# EAGLE board bmc (EAGLE 9.6.1)
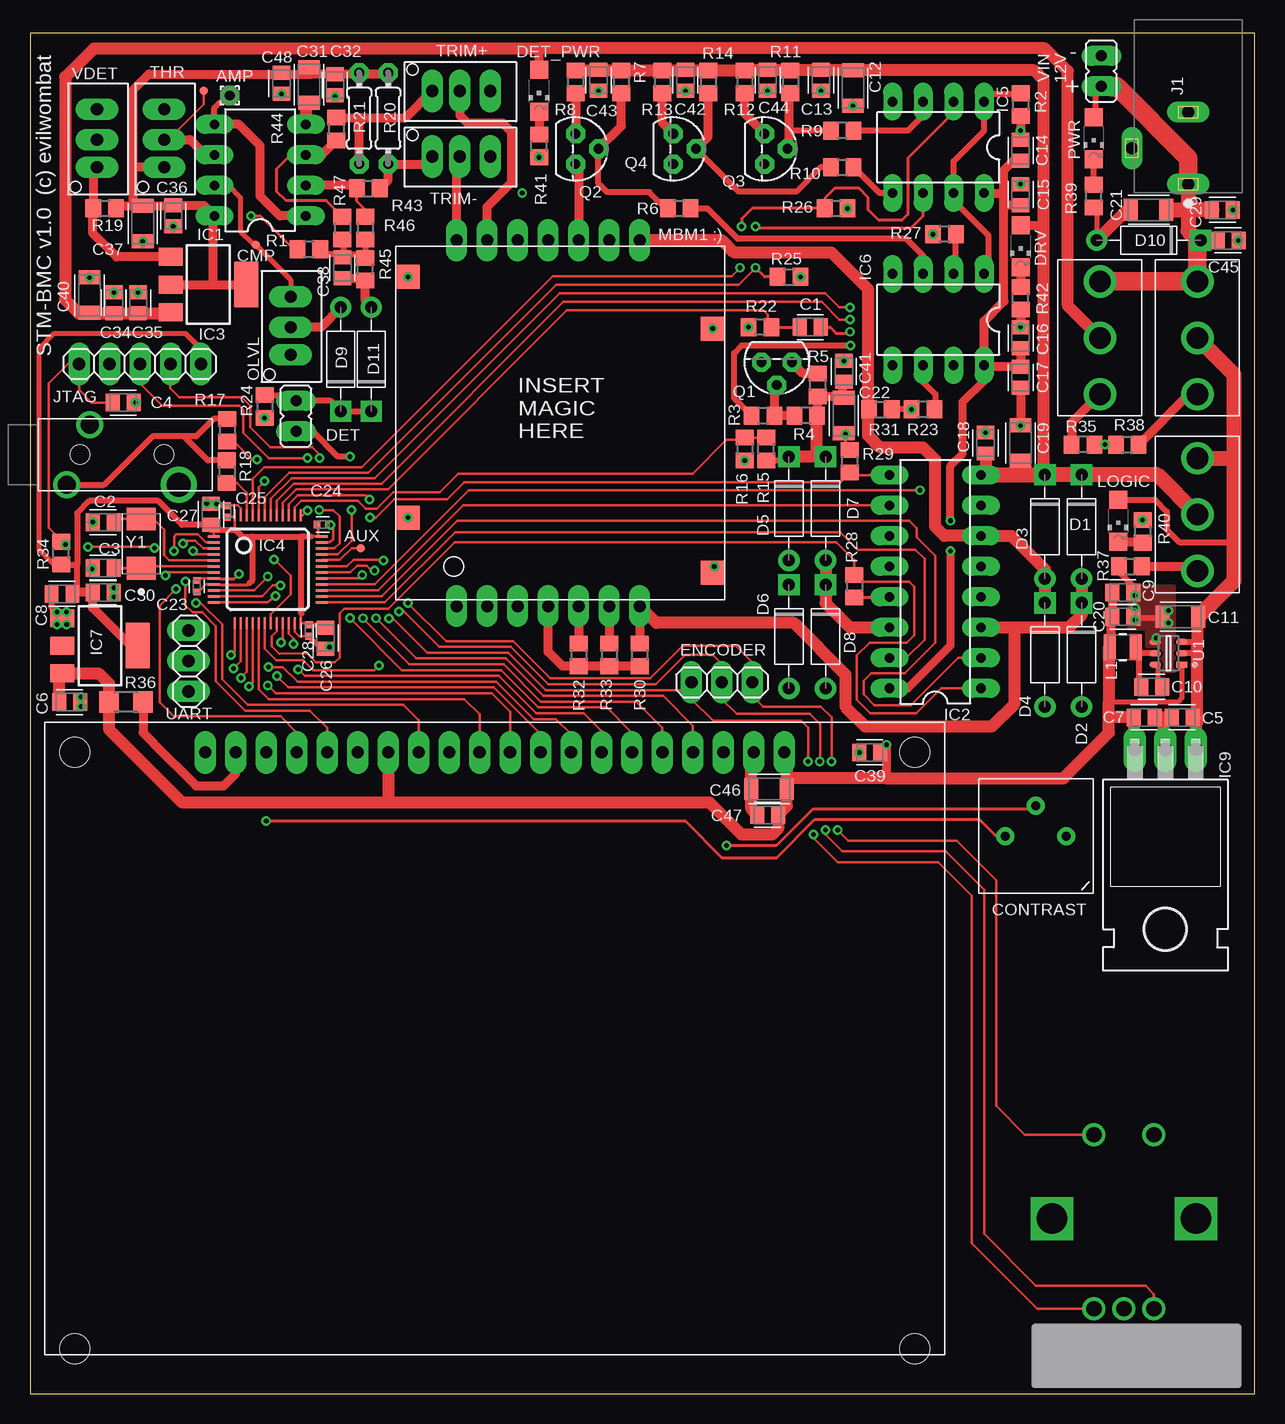
[diagram p2: board, top side]
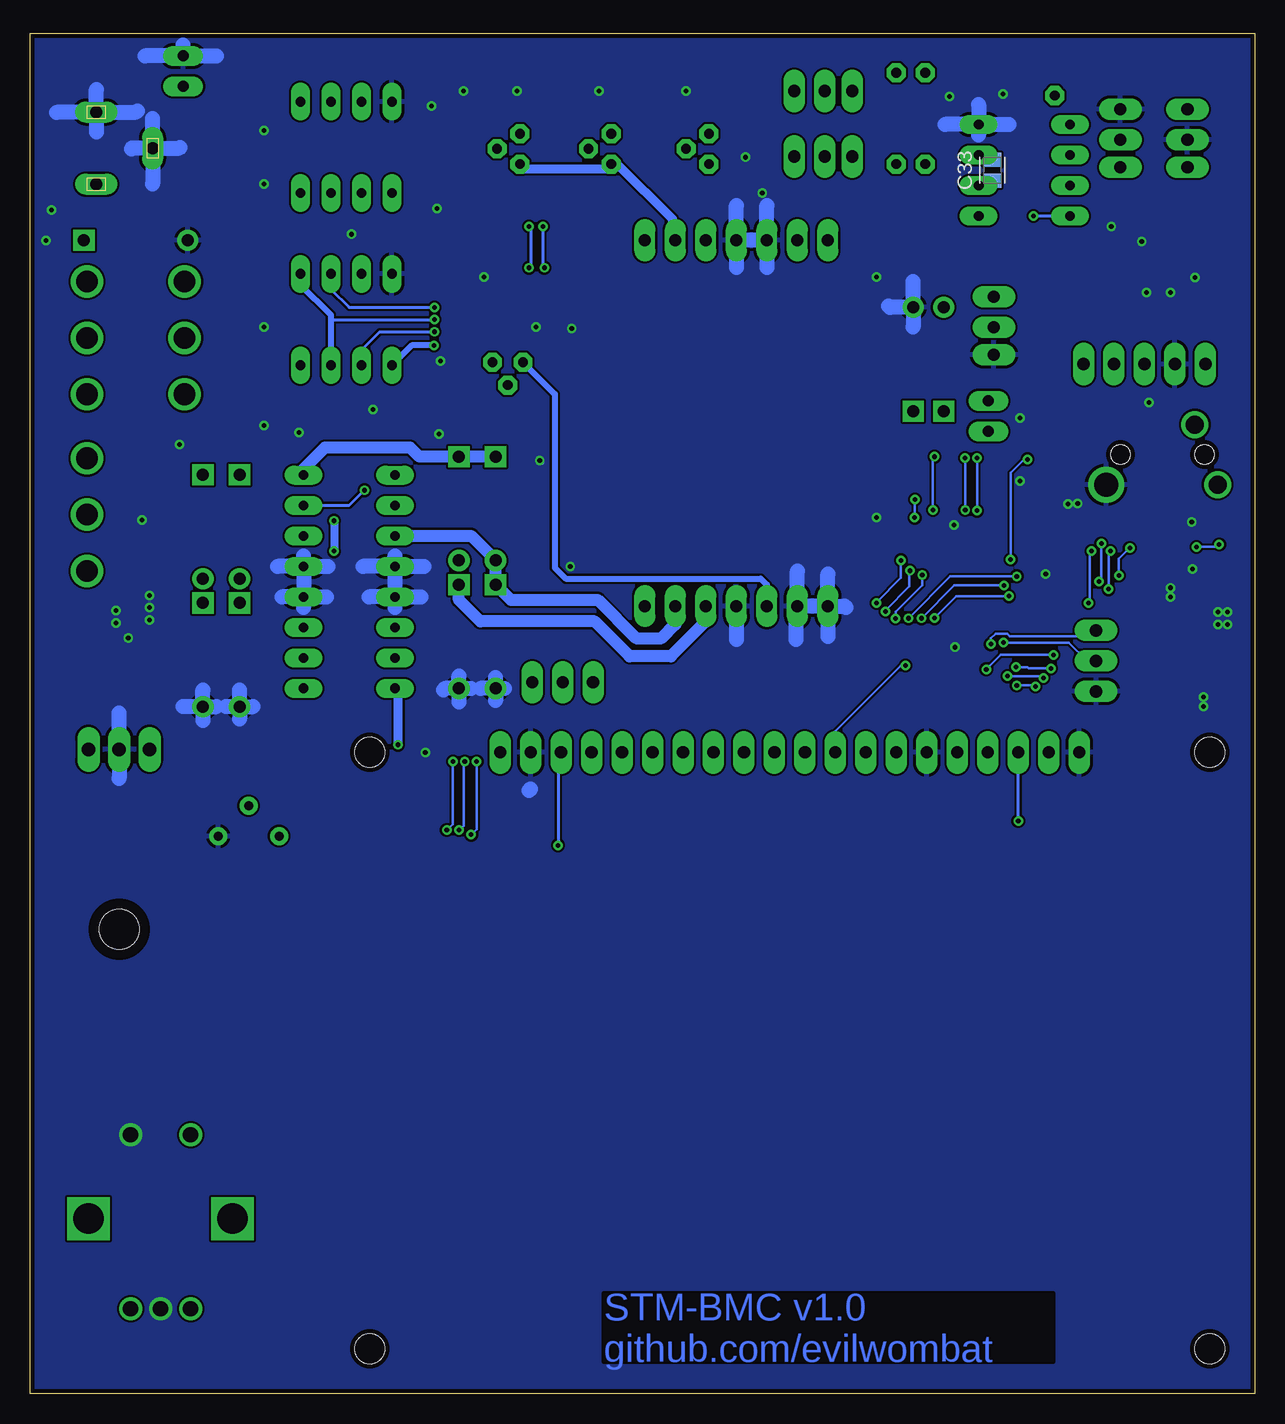
[diagram p3: board, bottom side, seen from below]

Size 102.04 x 113.41 mm. Coordinates in mm from the lower left corner, seen from the top.
Outline: 0,0 102.04,0 102.04,113.41 0,113.41 0,0
Copper layers (1*16): Top 0.035mm / dielectric 1.5mm / Bottom 0.035mm
Design rules "default *": minimum track width 7mil, minimum drill 15mil, track to track 7mil, track to pad 7mil, pad to pad 8mil, via to via 8mil, smd to smd 6mil, copper to edge 15mil, drill to drill 15mil, minimum pad ring 15mil, minimum via ring 8mil, stop-mask expansion 4mil, vias tented up to drill 0mil, thermal gap 10mil

## Footprints (pad centres in the part's own frame; a part is rotated, then mirrored left to right if it is on the bottom)
1,6/0,8 = drill 0.813 pad 1.6 octagon: 1 0,0
TP07R = smd 0.7 x 0.7: TP 0,0
CAPC2012X110 = smd 1.165 x 1.465: 1 -0.875,0; 2 0.875,0
CAPC3216X135 = smd 1.165 x 1.815: 1 -1.475,0; 2 1.475,0
CAPC1005X60 = smd 0.56 x 0.629: 1 -0.485,0; 2 0.485,0
DO-41 = drill 1: A 4.325,0 | drill 1 square: C -4.325,0
JP1 = drill 0.914 long: 1 0,-1.27; 2 0,1.27
CHIPLED_1206 = smd 1.5 x 1.5: A 0,-1.75; C 0,1.75
CFAG16864B = drill 1.016 long: 1 0,0; 2 2.54,0; 3 5.08,0; 4 7.62,0; 5 10.16,0; 6 12.7,0; 7 15.24,0; 8 17.78,0; 9 20.32,0; 10 22.86,0; 11 25.4,0; 12 27.94,0; 13 30.48,0; 14 33.02,0; 15 35.56,0; 16 38.1,0; 17 40.64,0; 18 43.18,0; 19 45.72,0; 20 48.26,0 | hole 2.5: 59.13,0; 59.13,49.7; -10.87,49.7; -10.87,0
1X03 = drill 1.016 long: 1 -2.54,0; 2 0,0; 3 2.54,0
DIL08 = drill 0.813 long: 1 -3.81,-3.81; 2 -1.27,-3.81; 3 1.27,-3.81; 4 3.81,-3.81; 5 3.81,3.81; 6 1.27,3.81; 7 -1.27,3.81; 8 -3.81,3.81
DIL16 = drill 0.813 long: 1 -8.89,-3.81; 2 -6.35,-3.81; 3 -3.81,-3.81; 4 -1.27,-3.81; 5 1.27,-3.81; 6 3.81,-3.81; 7 6.35,-3.81; 8 8.89,-3.81; 9 8.89,3.81; 10 6.35,3.81; 11 3.81,3.81; 12 1.27,3.81; 13 -1.27,3.81; 14 -3.81,3.81; 15 -6.35,3.81; 16 -8.89,3.81
SOT223 = smd 1.5 x 2: 1 -2.3,-3.15; 2 0,-3.15; 3 2.3,-3.15 | smd 3.8 x 2: 4 0,3.15
TQFP48 = smd 0.2 x 1: 1 -2.75,-4.5; 2 -2.25,-4.5; 3 -1.75,-4.5; 4 -1.25,-4.5; 5 -0.75,-4.5; 6 -0.25,-4.5; 7 0.25,-4.5; 8 0.75,-4.5; 9 1.25,-4.5; 10 1.75,-4.5; 11 2.25,-4.5; 12 2.75,-4.5; 25 2.75,4.5; 26 2.25,4.5; 27 1.75,4.5; 28 1.25,4.5; 29 0.75,4.5; 30 0.25,4.5; 31 -0.25,4.5; 32 -0.75,4.5; 33 -1.25,4.5; 34 -1.75,4.5; 35 -2.25,4.5; 36 -2.75,4.5 | smd 1 x 0.2: 13 4.5,-2.75; 14 4.5,-2.25; 15 4.5,-1.75; 16 4.5,-1.25; 17 4.5,-0.75; 18 4.5,-0.25; 19 4.5,0.25; 20 4.5,0.75; 21 4.5,1.25; 22 4.5,1.75; 23 4.5,2.25; 24 4.5,2.75; 37 -4.5,2.75; 38 -4.5,2.25; 39 -4.5,1.75; 40 -4.5,1.25; 41 -4.5,0.75; 42 -4.5,0.25; 43 -4.5,-0.25; 44 -4.5,-0.75; 45 -4.5,-1.25; 46 -4.5,-1.75; 47 -4.5,-2.25; 48 -4.5,-2.75
TO220H = drill 1.118 long: 1 -2.54,-10.16; 2 0,-10.16; 3 2.54,-10.16 | hole 3.302: 0,4.826
CUI_PJ-102A = drill 1 long: 1 -6.5,0; 2 -0.5,0; 3 -3.5,4.7
1X05 = drill 1.016 long: 1 -5.08,0; 2 -2.54,0; 3 0,0; 4 2.54,0; 5 5.08,0
WE-PMI_1008 = smd 1 x 2.2: 1 -1.1,0; 2 1.1,0
STX-3501-3N = drill 1.5: 1 -4,0.1; 3 1,-1.8 | drill 2: 2 -4,-9.2 | hole 1.6: -1.5,-1; -1.5,-8
PV36W = drill 1.016 long: 1 0,-2.286; 2 0,0; 3 0,2.54
TO92 = drill 0.813 octagon: 1 1.27,0; 2 0,1.905; 3 -1.27,0
R0805 = smd 1.3 x 1.5: 1 -0.95,0; 2 0.95,0
0204/7 = drill 0.813 octagon: 1 -3.81,0; 2 3.81,0
R1206 = smd 1.6 x 1.803: 1 -1.422,0; 2 1.422,0
SW_SPDT = drill 1.803: 1 -4.699,0; 2 0,0; 3 4.699,0
TP20SQ = smd 2 x 2: TP 0,0
DIODES_INC._AP63205WU-7_3 = smd 0.94 x 0.486: 1 -1.115,0.95; 2 -1.115,0; 3 -1.115,-0.95; 4 1.116,-0.95; 5 1.116,0; 6 1.116,0.95
3386-EY5 = drill 0.749: 1 -2.54,0; 2 0,-2.54; 3 2.54,0
MBM = drill 1 long: 1 -8.89,-15.24; 2 -6.35,-15.24; 3 -3.81,-15.24; 4 -1.27,-15.24; 5 1.27,-15.24; 6 3.81,-15.24; 7 6.35,-15.24; 8 6.35,15.24; 9 3.81,15.24; 10 1.27,15.24; 11 -1.27,15.24; 12 -3.81,15.24; 13 -6.35,15.24; 14 -8.89,15.24
XTAL_ECS-80-18-30-JGN-TR = smd 1.9 x 2.4: 1 -2.05,0; 2 2.05,0

## Placement (x,y rotation side)
AMP  [1,6/0,8]  16.64,108.2 0 top
AUX  TPTP07R  [TP07R]  27.56,70.48 0 top
C1  6.82nF  [CAPC2012X110]  65.02,88.9 0 top
C2  18pF  [CAPC2012X110]  6.1,72.64 180 top
C3  18pF  [CAPC2012X110]  6.1,68.83 180 top
C4  1uF  [CAPC2012X110]  7.77,82.61 0 top
C5  0.22uF  [CAPC2012X110]  96.01,56.39 180 top
C6  1uF  [CAPC2012X110]  3.3,57.66 0 top
C7  0.1uF  [CAPC2012X110]  92.84,56.39 0 top
C8  1uF  [CAPC2012X110]  2.67,66.67 180 top
C9  22uF  [CAPC2012X110]  91.06,66.8 0 top
C10  100nF  [CAPC2012X110]  93.47,58.93 0 top
C11  10uF  [CAPC3216X135]  95.89,64.77 180 top
C12  10uF  [CAPC3216X135]  68.58,108.84 270 top
C13  1uF  [CAPC2012X110]  65.91,109.47 270 top
C14  1uF  [CAPC2012X110]  82.55,103.63 90 top
C15  1uF  [CAPC2012X110]  82.55,99.95 90 top
C16  1uF  [CAPC2012X110]  82.55,88.01 90 top
C17  1uF  [CAPC2012X110]  82.55,84.71 270 top
C18  0.1uF  [CAPC2012X110]  79.63,79.25 90 top
C19  10uF  [CAPC3216X135]  82.55,79.25 90 top
C20  22uF  [CAPC2012X110]  91.06,64.77 0 top
C21  10uF  [CAPC3216X135]  93.22,98.68 180 top
C22  10uF  [CAPC3216X135]  67.82,81.53 270 top
C23  0.1uF  [CAPC1005X60]  13.91,67.31 90 top
C24  0.1uF  [CAPC1005X60]  24.41,72.45 0 top
C25  0.1uF  [CAPC1005X60]  16.41,73.54 90 top
C26  10uF  [CAPC2012X110]  24.64,62.99 270 top
C27  10uF  [CAPC2012X110]  15.09,73.29 90 top
C28  0.1uF  [CAPC1005X60]  23.24,63.63 270 top
C29  0.01uF  [CAPC2012X110]  99.36,98.68 0 top
C30  1uF  [CAPC2012X110]  6.1,66.8 0 top
C31  10uF  [CAPC3216X135]  23.24,109.09 270 top
C32  0.01uF  [CAPC2012X110]  25.4,109.09 270 top
C33  470pF  [CAPC2012X110]  21.84,101.98 90 bottom
C34  1uF  [CAPC2012X110]  6.99,90.93 90 top
C35  0.01uF  [CAPC2012X110]  9.02,90.93 90 top
C36  0.01uF  [CAPC2012X110]  11.94,98.17 270 top
C37  10uF  [CAPC3216X135]  9.4,97.54 270 top
C38  0.01uF  [CAPC2012X110]  26.04,93.85 270 top
C39  1uF  [CAPC2012X110]  69.98,53.47 180 top
C40  10uF  [CAPC3216X135]  4.95,91.57 90 top
C41  0.1uF  [CAPC2012X110]  67.82,85.22 90 top
C42  0.1uF  [CAPC2012X110]  54.61,109.47 270 top
C43  0.1uF  [CAPC2012X110]  47.37,109.47 270 top
C44  0.1uF  [CAPC2012X110]  61.47,109.47 270 top
C45  0.1uF  [CAPC2012X110]  99.84,96.14 0 top
C46  10uF  [CAPC3216X135]  61.59,50.42 180 top
C47  0.1uF  [CAPC2012X110]  61.47,48.26 180 top
C48  1uF  [CAPC2012X110]  20.96,109.22 270 top
CMP  TPTP07R  [TP07R]  18.8,95.76 0 top
D1  1N5817  [DO-41]  87.63,72.26 270 top
D2  1N5817  [DO-41]  87.63,61.59 270 top
D3  1N5817  [DO-41]  84.58,72.26 270 top
D4  1N5817  [DO-41]  84.58,61.59 270 top
D5  1N5817  [DO-41]  63.25,73.79 270 top
D6  1N5817  [DO-41]  63.25,63.12 270 top
D7  1N5817  [DO-41]  66.29,73.79 270 top
D8  1N5817  [DO-41]  66.29,63.12 270 top
D9  1N4148  [DO-41]  25.91,86.23 90 top
D10  1N4148  [DO-41]  93.22,96.14 180 top
D11  1N5226BTR  [DO-41]  28.45,86.23 90 top
DET  [JP1]  22.17,81.48 180 top
DET_PWR  YELLOW  [CHIPLED_1206]  42.42,108.59 180 top
DISP1  CFAG12864B  [CFAG16864B]  62.87,53.47 180 top
DRV  RED  [CHIPLED_1206]  82.55,95.63 180 top
ENCODER  [1X03]  57.66,59.31 0 top
IC1  TL072  [DIL08]  19.18,101.98 90 top
IC2  754410  [DIL16]  75.44,67.69 90 top
IC3  LM317MBSTT3  [SOT223]  14.86,92.46 270 top
IC4  STM32F10XCXT6  [TQFP48]  19.81,68.71 270 top
IC5  75462  [DIL08]  75.69,103.89 180 top
IC6  75462  [DIL08]  75.69,89.53 180 top
IC7  LD117AS12TR  [SOT223]  5.84,62.36 270 top
IC9  7805T  [TO220H]  94.62,43.56 180 top
J1  PJ-102A  [CUI_PJ-102A]  96.52,107.31 90 top
JTAG  [1X05]  9.17,85.83 180 top
L1  4.7uH  [WE-PMI_1008]  91.06,62.23 0 top
LOGIC  GREEN  [CHIPLED_1206]  90.68,72.77 180 top
MUSIC_OUT  STX-3501-3N  [STX-3501-3N]  3.17,79.78 90 top
OLVL  PV36W  [PV36W]  21.72,88.9 0 top
PWR  GREEN  [CHIPLED_1206]  88.65,104.65 180 top
Q1  2N3906  [TO92]  62.23,85.98 180 top
Q2  2N3906  [TO92]  45.47,103.76 270 top
Q3  2N3906  [TO92]  61.21,103.76 270 top
Q4  2N3906  [TO92]  53.59,103.76 270 top
R1  50k  [R0805]  23.24,95.38 180 top
R2  2k  [R0805]  82.55,107.44 270 top
R3  470  [R0805]  61.09,81.53 0 top
R4  470  [R0805]  64.64,81.53 180 top
R5  18  [R0805]  65.66,84.07 90 top
R6  470  [R0805]  54.1,98.81 0 top
R7  470  [R0805]  49.28,109.35 270 top
R8  82  [R0805]  45.47,109.35 270 top
R9  2.37k  [R0805]  67.69,105.28 180 top
R10  2.37k  [R0805]  67.69,102.23 0 top
R11  220  [R0805]  63.37,109.35 270 top
R12  10  [R0805]  59.56,109.35 270 top
R13  10  [R0805]  52.7,109.35 270 top
R14  274  [R0805]  56.51,109.35 270 top
R15  3k  [R0805]  61.34,78.74 90 top
R16  1k  [R0805]  59.56,78.74 270 top
R17  1k  [R0805]  16.43,80.31 270 top
R18  1k  [R0805]  16.41,76.86 270 top
R19  240  [R0805]  6.22,98.81 0 top
R20  1.3k  [0204/7]  29.85,106.3 90 top
R21  1.3k  [0204/7]  27.43,106.3 90 top
R22  200  [R0805]  60.83,88.9 180 top
R23  200  [R0805]  74.42,82.04 180 top
R24  1k  [R0805]  19.56,82.3 270 top
R25  1k  [R0805]  63.25,93.09 0 top
R26  1k  [R0805]  67.18,98.81 0 top
R27  1k  [R0805]  76.2,96.65 180 top
R28  1k  [R0805]  68.71,67.31 270 top
R29  1k  [R0805]  68.33,77.72 90 top
R30  10k  [R0805]  50.8,61.59 270 top
R31  10k  [R0805]  70.87,82.04 0 top
R32  10k  [R0805]  45.72,61.59 270 top
R33  10k  [R0805]  48.26,61.59 270 top
R34  10k  [R0805]  2.59,70.07 90 top
R35  1k  [R0805]  87.76,79.12 180 top
R36  82  [R1206]  8,57.66 0 top
R37  1k  [R0805]  91.69,68.96 0 top
R38  1k  [R0805]  91.44,79.12 0 top
R39  700  [R0805]  88.65,99.82 90 top
R40  700  [R0805]  92.71,71.88 270 top
R41  2500  [R0805]  42.42,104.01 90 top
R42  560  [R0805]  82.55,91.31 90 top
R43  0  [R0805]  28.19,100.46 0 top
R44  0  [R0805]  25.53,105.41 270 top
R45  50k  [R0805]  27.94,93.73 90 top
R46  100k  [R0805]  27.94,97.16 270 top
R47  100k  [R0805]  26.04,97.16 270 top
SW_DET  SW_SPDT  [SW_SPDT]  89.15,88.01 90 top
SW_DRV  SW_SPDT  [SW_SPDT]  97.28,73.28 90 top
SW_LOGIC  SW_SPDT  [SW_SPDT]  97.28,88.01 90 top
THR  PV36W  [PV36W]  11.18,104.52 0 top
TP1  TPTP20SQ  [TP20SQ]  31.5,93.09 0 top
TP2  TPTP20SQ  [TP20SQ]  56.9,68.45 0 top
TP3  TPTP20SQ  [TP20SQ]  56.9,88.77 0 top
TP4  TPTP20SQ  [TP20SQ]  31.5,73.03 0 top
TP10  TPTP07R  [TP07R]  14.48,108.59 0 top
TRIM+  PV36W  [PV36W]  35.81,108.59 270 top
TRIM-  20 Ohm  [PV36W]  35.81,103.12 270 top
U1  DIODES_INC._AP63205WU-7DIODES_INC._AP63205WU-7_0_3  [DIODES_INC._AP63205WU-7_3]  94.87,61.72 180 top
U$1  TP3386  [3386-EY5]  83.82,46.48 180 top
U$5  TIB_S0004  [MBM]  44.45,80.9 0 top
UART  [1X03]  13.21,61.09 90 top
VDET  PV36W  [PV36W]  5.59,104.52 0 top
VIN  [JP1]  89.28,110.24 180 top
Y1  ECS-80-18-30-JGN-TR  [XTAL_ECS-80-18-30-JGN-TR]  9.27,70.87 90 top

## Tracks (layer width: path | path; a pad name or v marks a point on that pad's centre or on a via)
+3V3
  Top 0.203: 24.39,64.11 C26.1 | C28.1 23.53,64.11 23.62,64.21 IC4.24 22.56,64.98 22.61,65.02 | C23.1 13.92,66.84 14.05,66.84 14.67,67.46 IC4.9 15.79,67.46 15.81,67.44 | IC4.36 24,71.46 | 24,71.46 23.45,71.46 23.43,71.44 | IC4.1 15.31,71.89 15.43,72.01 | IC4.48 17.06,73.1 | 17.06,73.1 17.06,72.05 17.1,72.01 | C27.1 15.09,72.01 | 16.48,73.13 C25.1 16.45,73.1 17.06,73.1 | 2,69.12 R34.1 | C24.1 24,72.37 24,71.46
  Top 0.254: 18.29,67.57 18.16,67.44 15.81,67.44 | 18.55,67.83 18.54,67.84
  Top 0.406: C28.1 24.39,64.11 | 2,69.12 0.76,70.36 0.76,87.12 2.03,88.39 12.95,88.39 14.25,87.1 JTAG.1
  Top 0.508: 15.09,72.01 15.43,72.01 17.1,72.01 17.67,71.44 18.54,71.44 | 18.54,71.44 22.61,71.44 | 22.61,65.02 22.61,71.44 | 23.43,71.44 22.61,71.44 | 18.54,67.84 18.54,71.44 | 18.29,67.57 18.55,67.83 | C27.1 12.67,72.42 10.67,74.42 4.95,74.42 3.94,73.41 3.94,69.12 | 3.94,69.12 3.94,66.67 C8.1 | R34.1 3.94,69.12
  Top 0.762: IC7.4 8.38,62.36 5.22,65.52 C30.1 3.67,66.8 C8.1
+5V  (via drill 0.38)
  Top 0.254: 71.37,53.34 70.98,53.34 C39.1
  Top 0.406: L1.1 89.96,62.91 90.04,62.99 | U1.1 95.98,58.01 95.63,57.66 89.92,57.66
  Top 0.66: IC2.16 73.15,58.8 76.71,62.36 v76.71,70.23 | IC6.8 79.5,84.45 77.72,82.68 77.72,78.36 76.71,77.34 v76.71,72.77
  Top 0.762: C9.1 C20.1 90.04,64.63 90.04,62.99 | v71.37,54.1 71.37,53.34 71.37,51.31 | C16.1 C17.1 79.64,85.58 IC6.8 79.5,89.41 81.15,91.06 81.15,98.81 | 81.15,98.81 81.15,100.08 | 81.15,100.08 81.15,101.98 81.93,102.76 C14.1 | IC5.8 81.15,100.08 | C15.1 81.42,99.07 81.15,98.81
  Top 1.016: 89.92,56.39 89.92,55.12 86.11,51.31 71.37,51.31 63.07,51.31 | 89.92,56.39 89.92,57.66 89.92,62.19 L1.1 | C6.1 2.43,59.79 IC7.3 5.73,60.06 6.58,59.21 R36.1 6.58,55.4 12.7,49.28 29.85,49.28 | IC9.3 91.96,53.83 C7.1 89.92,56.39 | DISP1.1 63.07,53.26 63.07,51.31 | 63.07,51.31 C46.1 63.07,48.99 C47.1 62.34,47.1 61.85,46.61 59.31,46.61 56.64,49.28 29.85,49.28 | DISP1.14 29.85,49.28
  Bottom 0.66: v76.71,72.77 v76.71,70.23
  Bottom 0.762: v71.37,54.1 71.37,58.55 IC2.16
  Bottom 1.016: 92.34,53.98 IC9.3
BUBBLES_OUT  (via drill 0.38)
  Top 0.203: IC4.33 25.63,69.96 26.8,71.12 v26.8,73.66
  Top 0.508: v26.67,78.1 25.65,78.1 23.55,80.21 DET.2
  Bottom 0.203: v26.67,78.1 26.8,77.98 v26.8,73.66
BUBBLES_OUT_JP
  Top 0.508: R24.1 21.68,83.25 DET.1 25.06,82.75 D9.C D11.C
CMP_OUT
  Top 0.406: IC1.7 16.51,100.71 17.53,99.69 17.53,96.9 18.54,95.88 18.8,95.88 CMP.TP 21.72,92.84 OLVL.3
CX+
  Top 0.762: U$5.7 R30.1
  Top 1.016: IC2.3 82.04,63.88 | 82.04,63.88 86.61,63.88 87.63,64.9 D2.C D1.A | 82.04,63.88 82.04,57.53 80.14,55.63 69.6,55.63 67.95,57.28 67.95,59.94 63.63,64.26 52.2,64.26 U$5.7
CX-
  Top 0.508: R31.1 69.85,82.04
  Top 1.016: D4.C D3.A 84.58,68.71 81.79,71.5 IC2.6 76.2,71.5 75.44,72.26 75.44,77.85 74.42,78.87 70.87,78.87 69.85,79.88 69.85,82.04 69.85,92.07 66.8,95.12 58.7,95.12 57.68,96.14 U$5.8 50.8,95.38 51.05,95.12
CX_EN
  Top 0.203: IC4.20 20.56,63.57 20.14,63.15 20.14,62.33 20.77,61.7 23.05,61.71 23.8,60.96 25.4,60.96 25.81,61.37 25.81,65.05 26.21,65.45 29.87,65.45 35.41,70.99 67.18,70.99 68.71,69.47 R28.1 | 69.28,67.69 73.28,67.69 73.7,67.27 73.7,63.25 73.06,62.61 69.98,62.61 68.91,61.54 68.91,57.84 70.03,56.72 73.86,56.72 75.95,58.8 IC2.1
  Top 0.254: 69.28,67.69 R28.1
CXA
  Top 0.203: IC2.2 77.34,61.34 73.41,57.4 70.37,57.4 69.47,58.3 69.47,59.44 70.1,60.07 72.9,60.07 75.44,62.61 75.44,69.85 73.91,71.37 73.91,72.14 73.28,72.77 35.61,72.77 29.29,66.46 IC4.26
CXB  (via drill 0.38)
  Top 0.203: v74.17,75.31 36.57,75.31 28.71,67.46 IC4.28
  Bottom 0.254: IC2.7 75.44,74.04 v74.17,75.31
CY+
  Top 0.762: U$5.6 R33.1
  Bottom 1.016: IC2.11 65.29,71.5 D5.A D6.C 61.98,66.17 54.74,66.17 51.55,62.99 49.4,62.99 48.26,64.13 U$5.6
CY-
  Top 0.762: U$5.5 R32.1
  Top 1.016: D7.A D8.C 66.29,65.91 68.33,63.88 IC2.14
  Bottom 1.016: U$5.5 45.72,64.39 48.64,61.47 52.07,61.47 54.99,64.39 64.52,64.39 66.29,66.17 D8.C
CY_EN  (via drill 0.38)
  Top 0.178: 68.14,76.58
  Top 0.203: IC4.39 21.56,74.14 22.3,74.88 27.96,74.88 v28.3,74.55 | IC2.9 68.14,76.58 | R29.1 67.55,76 36.21,76 34.76,74.55 30.35,74.55 28.83,73.03 v28.32,73.03
  Top 0.254: 68.14,76.58 R29.1
  Bottom 0.203: v28.32,73.03 28.3,73.05 v28.3,74.55
CYA
  Top 0.203: IC2.10 36.09,74.04 29,66.96 IC4.27
CYB
  Top 0.203: IC4.25 29.58,65.96 35.43,71.81 67.51,71.81 68.96,70.36 73.79,70.36 74.55,69.6 74.55,62.86 73.03,61.34
  Top 0.254: IC2.15 73.03,61.34
DET1
  Top 0.762: U$5.14 35.56,101.47 35.81,101.73 TRIM-.2
DET2
  Top 0.762: U$5.13 38.1,98.93 40.13,100.97 40.13,105.16 39.37,105.92 36.45,105.92 35.81,106.55 TRIM+.2
DRIVE_STATE
  Top 0.178: R16.1 59.37,79.5
  Top 0.203: R16.1 R15.2 | 59.37,79.5 58.04,79.5 55.22,76.68 35.67,76.68 34.14,75.16 30.28,75.16 28.9,73.77 27.97,73.77 27.33,74.42 22.61,74.42 22.06,73.88 IC4.38
ENC_A  (via drill 0.38, 1.27)
  Top 0.203: IC4.29 27.41,67.96 v27.69,68.24 | v64.82,52.7 64.87,52.76 64.87,55.5 64.26,56.11 56.92,56.11 55.12,57.91 ENCODER.1 54.47,58.66 42.97,58.66 39.86,61.77 33.12,61.77 30.25,64.64 v29.91,64.64 | v65.28,46.61 65.28,46.35 67.31,44.32 75.69,44.32 78.49,41.53 78.49,12.57 83.95,7.11 v88.66,7.11
  Bottom 0.203: v27.69,68.24 27.69,67.41 29.91,65.19 v29.91,64.64 | v65.28,46.61 64.82,47.07 v64.82,52.7
ENC_B  (via drill 0.38, 1.27)
  Top 0.203: v28.7,68.61 28.49,68.61 28.06,69.04 27.25,69.04 26.67,68.46 IC4.30 | v65.81,52.7 65.84,52.7 65.84,55.82 64.96,56.69 58.88,56.69 57.66,57.91 ENCODER.2 57.79,59.44 57.79,60.71 56.9,61.59 54.59,61.59 52.14,59.14 43.17,59.14 40.06,62.25 34.09,62.25 31.13,65.22 v30.74,65.22 | v66.29,46.99 66.29,46.61 67.69,45.21 76.33,45.21 79.5,42.04 79.5,13.34 83.82,9.02 92.96,9.02 93.66,8.32 v93.66,7.11
  Bottom 0.203: v28.7,68.61 28.75,68.56 28.75,67.31 30.74,65.33 v30.74,65.22 | v65.81,52.7 65.91,52.6 65.91,47.37 v66.29,46.99
ENC_SW  (via drill 0.38, 1.27)
  Top 0.203: IC4.31 26.41,68.96 26.99,69.53 29.4,69.53 v29.46,69.47 | v31.5,65.91 34.67,62.74 40.26,62.74 43.37,59.63 51.68,59.63 54.41,62.36 58.8,62.36 60.2,60.96 ENCODER.3 | 60.2,60.07 ENCODER.3 | ENCODER.3 60.2,58.17 61.09,57.28 65.91,57.28 66.8,56.39 v66.8,52.7 | v67.31,46.99 68.2,46.1 77.22,46.1 80.52,42.8 80.52,24 82.91,21.61 v88.66,21.61
  Bottom 0.203: v29.46,69.47 29.46,68.01 31.5,65.98 v31.5,65.91 | v66.8,52.7 66.8,47.5 v67.31,46.99
FUNC_ANN  (via drill 0.38)
  Top 0.203: IC4.42 20.07,74.58 21.8,76.31 28.75,76.31 44.15,91.72 66.26,91.72 67.43,90.55 v68.33,90.55
  Top 0.508: IC6.2 77.15,93.53 R27.1
  Bottom 0.254: IC6.2 76.96,92.07 75.44,90.55 v68.33,90.55
FUNC_GEN
  Top 0.203: IC4.40 21.06,74.29 22.18,75.4 29.84,75.4 44.74,90.3 61.09,90.3 61.47,89.92 61.47,89.22 R22.1
  Top 0.254: R22.1 C1.1
FUNC_GEN_SAFE  (via drill 0.38)
  Top 0.254: C1.2 66.68,88.9 67.18,88.39 68.2,88.39 v68.33,88.52
  Top 0.508: IC6.6 74.42,84.33 75.44,83.31 75.44,82.11 R23.1
  Bottom 0.254: IC6.6 74.42,87 72.9,88.52 v68.33,88.52
FUNC_XIN  (via drill 0.38)
  Top 0.203: IC4.45 18.56,76.26 19.54,77.24 27.66,77.24 43.56,93.14 58.47,93.14 v59.18,93.85
  Top 0.254: IC5.2 76.96,106.81 73.15,103 73.15,98.3 72.64,97.79 70.74,97.79 69.85,98.68 69.85,99.69 69.09,100.46 67.06,100.46 66.23,99.63 R26.1 60.2,98.81 59.31,97.92 v59.31,97.28
  Bottom 0.254: v59.31,97.28 59.31,93.98 v59.18,93.85
FUNC_XOUT  (via drill 0.38)
  Top 0.203: IC4.43 19.56,74.73 21.61,76.77 28.2,76.77 43.86,92.43 59.05,92.43 60.45,93.83 v60.45,93.85
  Top 0.254: IC5.6 74.42,98.17 73.41,97.16 60.58,97.16 v60.45,97.28 | R25.1 61.21,93.09 v60.45,93.85
  Bottom 0.254: v60.45,97.28 60.32,97.16 60.32,93.98 v60.45,93.85
GND  (via drill 0.38, 1.27)
  Top 0.203: IC4.23 22.06,63.54 22.46,63.14 C28.2 | C26.2 24.96,61.8 v24.96,62.23 24.15,62.23 | C23.2 14.07,67.96 IC4.8 15.8,67.96 15.81,67.95 | IC4.35 24.98,70.96 25.27,71.25 25.27,72.19 v25.06,72.4 | IC4.47 17.56,73.83 17.33,74.06 16.06,74.06 16.03,74.03 | C4.2 v8.78,82.61 | IC4.44 19.06,75.58 v19.56,76.07 | C12.2 68.15,107.36 67.95,107.57 68.34,107.57 v68.58,107.33
  Top 0.254: IC2.13 71.57,66.36 R28.2 | R29.2 67.95,79.06 v67.95,80.01 | v92.08,66.55 92.08,66.29 92.08,64.77 C11.2 94.41,64.52 v92.08,64.52 | v17.4,68.33 17.02,67.95 15.81,67.95 | C6.2 4.27,57.75 v4.27,58.06 | C24.2 25,72.45 v25.06,72.4 | C27.2 14.76,74.17 v14.73,74.19 | C12.2 68.79,107.57 69.09,107.57 68.88,107.36 C12.2 | C13.2 66.15,108.84 66.42,108.84 66.18,108.6 C13.2 | C44.2 61.71,108.84 61.98,108.84 61.74,108.6 C44.2 | C42.2 54.85,108.84 55.24,108.84 55,108.6 C42.2 | C43.2 47.61,108.84 47.88,108.84 47.64,108.6 C43.2
  Top 0.406: C28.2 24.15,62.23 | R39.1 88.89,98.62 D10.A
  Top 0.508: R31.2 R23.2 v73.47,82.04 | R37.1 90.74,68.51 92.08,67.18 92.08,66.29 | R35.1 v89.6,79.12 R38.1 | C22.2 67.87,80.01 | 3.06,64.26 v3.06,64.11 | C8.2 1.79,65.56 IC7.1 | C25.2 16.03,74.03 15.23,74.03 C27.2 | 27.74,92.98 R45.1 | C30.2 6.99,66.79 v6.99,66.42 | C37.2 v9.4,96.03 | C16.2 v82.55,88.91 | v5.23,72.68 5.23,72.66 C2.2 | C3.2 5.22,68.81 v5.17,68.76 | C32.2 v25.4,108.13 | 82.55,81.15 C19.2
  Top 0.762: R2.2 v82.55,105.28 C14.2 | C17.2 82.55,81.15 | R42.1 v82.55,88.91 | 67.87,80.01 v67.95,80.01 | R30.2 R33.2 R32.2 44.38,60.64 43.18,61.85 U$5.4 | D11.A 27.94,91.07 R45.1 | C38.2 27.74,92.98
  Top 1.016: C21.2 91.74,98.81 91.56,98.81 D10.A | IC7.1 3.06,64.29 3.06,64.26 | C7.2 94.49,56.39 | 94.49,56.39 C5.2 | IC9.2 94.49,53.85 94.49,56.39 | DISP1.2 60.12,53.26 C46.2 60.12,48.73 C47.2 | C31.2 22.99,107.36 IC1.4 | TP2.TP 56.9,68.83 v57.02,68.96
  Bottom 0.508: R16.2 59.44,77.66
  Bottom 1.27: U$5.12 40.64,99.06 | U$5.12 40.64,93.85 | U$5.11 43.18,93.85 | U$5.11 43.18,99.06 | U$5.12 U$5.11 | IC1.4 20.45,105.79 | IC1.4 25.78,105.79 | 22.99,107.44 IC1.4 | IC1.4 22.99,104.93 | D11.A 28.45,92.71 | D11.A 30.36,90.56 30.48,90.68 | D11.A 28.45,88.9 | 60.32,50.42 60.45,50.29 | U$5.2 38.1,68.58 | U$5.2 38.23,65.53 38.23,62.86 | U$5.1 35.56,63.12 | U$5.1 34.16,65.66 34.04,65.53 | U$5.1 35.56,68.33 | U$5.1 U$5.2 | U$5.4 43.18,62.86 | IC2.12 74.3,68.96 | IC2.12 69.22,68.96 | IC2.12 71.63,69.83 | IC2.12 IC2.13 | IC2.13 73.79,66.42 | IC2.13 69.47,66.42 | IC2.13 71.63,65.56 | IC2.5 77.25,68.96 77.24,68.95 77.22,68.95 | IC2.5 79.25,69.83 | IC2.5 81.41,68.96 | IC2.5 IC2.4 | IC2.4 79.25,65.56 | IC2.4 81.03,66.42 | IC2.4 77.34,66.42 | D8.A 66.29,59.82 | D8.A 66.29,57.66 | D8.A 67.44,58.79 67.56,58.67 | D8.A 65.29,58.79 65.28,58.8 | D6.A 64.52,58.8 | D6.A 63.25,59.69 | D6.A 62.49,58.79 62.48,58.8 | D6.A 63.25,57.78 | D2.A 87.63,58.67 | D2.A 89.28,57.28 | D2.A 87.63,56.13 | D2.A 86.49,57.27 86.49,57.28 | D4.A 85.73,57.28 | D4.A 84.58,58.67 | D4.A 83.45,57.27 83.44,57.28 | D4.A 84.58,56.26 | 94.62,56.77 IC9.2 94.62,51.31 | J1.2 96.52,108.71 | J1.2 96.52,105.16 | J1.2 96.53,106.81 99.82,106.81 | J1.2 93.21,106.81 93.09,106.93 | J1.3 91.82,106.3 | J1.3 93.54,103.81 93.6,103.76 | J1.3 89.61,103.81 89.54,103.89 | J1.3 91.82,100.84 | VIN.1 92.46,111.51 | VIN.1 86.49,111.51 | VIN.1 89.28,112.39 | D10.A 89.03,96
  other vias: 93.66,21.61 91.16,7.11 15.54,74.17 59.56,77.79 75.25,96.65 68.13,98.81 59.88,88.9 64.2,93.09 79.63,80.12 93.85,62.99 94.87,65.28 94.87,64.26 92.08,65.53 92.71,72.83 82.55,100.82 65.91,108.6 42.42,103.06 100.24,98.68 2.24,65.15 2.24,64.13 3.05,65.15 19.56,81.35 4.24,57.28 6.99,67.18 9.02,91.81 6.99,91.81 11.94,97.3 69.1,53.47 31.5,93.09 31.5,73.03 56.9,88.77 4.95,93.04 67.82,86.09 54.61,108.6 47.37,108.6 61.47,108.6 100.71,96.14 41.02,100.08 82.55,80.72 20.96,108.34
  pour Bottom: -0.38,113.66 102.49,113.66 102.49,-0.38 -0.38,-0.38
  pour Top (no thermals): 94.11,60.21 95.38,60.2 95.38,67.31 91.57,67.31 91.57,63.75 93.04,63.75 93.04,62.23 94.11,62.23
IANN
  Top 0.762: Q2.1 45.72,102.23 U$5.10
IGEN
  Bottom 0.508: U$5.3 40.64,67.44 41.15,67.94 57.4,67.94 58.29,68.83 58.29,83.31 Q1.1
IXFER
  Bottom 0.762: Q3.1 60.83,102.11 53.59,102.11 Q4.1 53.09,102.49 48.51,97.92 48.51,96.39 U$5.9
LCD_BL+
  Top 0.762: R36.2 9.42,55.12 10.29,54.25 10.29,54.23 13.84,50.67 16.13,50.67 17.14,51.69 DISP1.19
LCD_CS1  (via drill 0.38)
  Top 0.203: IC4.18 19.56,62.1 20.52,61.14 22.77,61.14 23.58,60.33 28.7,60.33 v29.08,60.71
  Bottom 0.203: DISP1.12 34.92,55.24 29.46,60.71 v29.08,60.71
LCD_CS2  (via drill 0.38)
  Top 0.203: IC4.4 13.86,69.96 v13.59,70.23 | v13.84,65.91 14.22,65.91 16,64.13 16,59.56 18.14,57.43 31.11,57.43 32.38,56.16 DISP1.13
  Bottom 0.203: v13.59,70.23 13.58,70.22 13.74,70.05 13.74,66.02 v13.84,65.91
LCD_D0  (via drill 0.38)
  Top 0.203: IC4.10 18.67,66.96 19.81,68.1 v19.81,68.14 | DISP1.4 55.24,55.7 52.77,58.18 42.77,58.18 39.66,61.29 32.2,61.29 28.85,64.64 v28.83,64.64
  Bottom 0.203: v19.81,68.14 25.34,68.14 v28.83,64.64
LCD_D1  (via drill 0.38)
  Top 0.203: IC4.11 19.35,66.47 20.25,67.37 v20.89,67.37 | DISP1.5 52.7,55.5 50.51,57.7 42.57,57.7 39.46,60.81 31.59,60.81 v27.75,64.64
  Bottom 0.203: v27.75,64.64 25.02,67.37 v20.89,67.37
LCD_D2  (via drill 0.38)
  Top 0.203: IC4.12 19.8,65.96 v20.45,66.48 | DISP1.6 50.16,55.12 48.07,57.21 42.37,57.21 39.26,60.33 31,60.33 v26.67,64.65
  Bottom 0.203: v20.45,66.48 24.84,66.48 v26.67,64.65
LCD_D3  (via drill 0.38)
  Top 0.203: IC4.13 17.06,61.89 v16.76,61.59 | DISP1.7 47.62,55.24 46.14,56.73 42.17,56.73 39.06,59.84 22.9,59.84 v22.35,60.39
  Bottom 0.203: v16.76,61.59 21.15,61.59 v22.35,60.39
LCD_D4  (via drill 0.38)
  Top 0.203: DISP1.8 45.09,54.99 43.83,56.25 41.97,56.25 38.86,59.36 22.3,59.36 21.08,60.58 v19.86,60.58 | IC4.14 17.56,61.07 v16.96,60.47
  Bottom 0.203: v16.96,60.47 18.81,60.47 18.92,60.58 v19.86,60.58
LCD_D5  (via drill 0.38)
  Top 0.203: IC4.15 18.06,60.17 v17.58,59.68 | DISP1.9 42.54,54.99 38.66,58.88 21.51,58.88 v20.57,59.82
  Bottom 0.203: v17.58,59.68 17.71,59.82 v20.57,59.82
LCD_D6  (via drill 0.38)
  Top 0.203: IC4.16 18.56,59.27 v18.26,58.97 | DISP1.10 40,56.85 38.46,58.39 20.46,58.39 v19.81,59.04
  Bottom 0.203: v18.26,58.97 18.34,59.04 v19.81,59.04
LCD_D7
  Top 0.203: IC4.17 19.06,59.56 19.06,58.73 19.88,57.91 36.2,57.91 37.46,56.64 DISP1.11
LCD_DI  (via drill 0.38)
  Top 0.203: v12.76,70.87 13.02,71.12 13.78,71.12 14.44,70.46 IC4.3 | DISP1.16 24.77,55.5 23.32,56.95 17.94,56.95 15.49,59.39 15.49,63.99 14.36,65.13 13.57,65.13 12.95,65.74 v12.95,67.69
  Bottom 0.203: v12.95,67.69 12.76,67.88 v12.76,70.87
LCD_EN  (via drill 0.38)
  Top 0.203: IC4.2 14.64,70.96 13.97,71.63 12.19,71.63 12,71.44 v12,70.23 | DISP1.17 22.23,55.12 20.88,56.46 11.99,56.46 10.8,57.66 10.8,65.7 v12.17,67.07
  Bottom 0.203: v12.17,67.07 12.17,70.07 v12,70.23
LCD_VEE  (via drill 0.38)
  Top 0.254: U$1.3 80.52,46.48 79.12,47.88 65.41,47.88 62.23,44.7 57.66,44.7 54.61,47.75 v19.69,47.75
  Bottom 0.254: v19.69,47.75 DISP1.18
LCD_VO  (via drill 0.38)
  Top 0.254: U$1.2 83.82,48.77 65.27,48.77 62.22,45.72 v58.04,45.72
  Bottom 0.254: DISP1.3 58.04,53.21 v58.04,45.72
MCU_RESET  (via drill 0.38)
  Top 0.203: v11.3,68.21 v11.31,68.21 11.56,68.46 IC4.7 | v10.39,70.49 10.29,70.59 v4.84,70.59 | v2.95,70.79 1.55,72.19 1.55,84.23 3.17,85.85 4.06,85.85 JTAG.5 4.09,83.67 5.14,82.61 C4.1
  Top 0.508: R34.2 2.95,71.02 v2.95,70.79
  Bottom 0.203: v11.3,68.21 11.3,69.61 10.42,70.49 v10.39,70.49 | v4.84,70.59 3.28,70.59 3.07,70.79 v2.95,70.79
N$1
  Top 0.203: IC4.6 9.41,68.96 Y1.1 6.99,68.82 C3.1
N$2
  Top 0.203: C2.1 7.24,72.92 Y1.2 10.29,72.92 11.18,72.03 11.18,69.9 11.62,69.46 IC4.5
N$3
  Top 0.762: D9.A 24.25,88.9 OLVL.2
N$4
  Top 0.254: R47.1 24.7,99.44 21.34,99.44 20.57,100.2 20.57,102.11 21.72,103.25 IC1.3
  Top 0.762: IC1.3 24.32,103.25 R44.2
  Bottom 0.508: C33.2 22.24,103.25 IC1.3
N$5
  Top 0.762: Q1.2 62.04,83.88 R3.2 R4.2
N$6  (via drill 0.38)
  Top 0.508: R3.1 58.67,83 58.67,86.74 59.31,87.38 v68.39,87.38
  Bottom 0.508: v68.39,87.38 70.23,87.38 IC6.5
N$7
  Top 0.762: R5.2 64.45,85.02 Q1.3
N$8
  Top 0.508: R6.2 56.45,98.81 58.99,96.27 73.03,96.27 74.42,94.87 IC6.3
N$9
  Top 0.508: R6.1 52.96,98.81 51.61,100.16 48.09,100.16 47.37,100.88 Q2.2
  Top 0.762: Q2.2 49.28,105.66 R7.2
N$10
  Top 0.508: R9.1 73.15,105.28 74.42,106.55 IC5.3
N$11
  Top 0.762: R8.2 Q2.3
N$12
  Top 0.508: R10.2 70.8,100.08 IC5.5
N$13
  Top 0.762: Q3.3 59.56,106.68 R12.2
N$14
  Top 0.508: R9.2 63.25,105.28
  Top 0.762: R11.2 63.25,108.27 63.25,105.28 63.25,103.89 Q3.2
N$15
  Top 0.508: Q4.2 59.05,100.2 63.88,100.2 65.91,102.23 R10.1
  Top 0.762: Q4.2 56.51,104.78 R14.2
N$16
  Top 0.762: Q4.3 52.7,105.92 R13.2
N$17
  Top 0.254: R46.1 28.51,98.1 27.21,99.41 27.21,100.49 R43.1
  Top 0.762: R43.1 26.99,100.71 IC1.2
  Bottom 0.508: IC1.2 22.24,100.71 C33.1
N$18
  Top 0.762: VDET.1 5.27,101.92 R19.1 5.21,98.74 5.21,96.77 7.23,94.76 IC3.1
N$20
  Top 0.762: SW_DET.1 86.81,80.97 R35.2
N$21
  Top 0.762: R37.2 96.9,68.96 SW_DRV.1
N$22
  Top 0.762: SW_LOGIC.1 96.58,83.31 R38.2
N$24
  Top 0.508: U1.5 92.16,61.72 L1.2 92.41,61.98 92.41,59.11 C10.1
N$25
  Top 0.508: R39.2 PWR.C
N$26
  Top 0.762: LOGIC.C 92.62,71.02 R40.2
N$27
  Top 0.762: DET_PWR.C R41.2
N$31
  Top 0.762: DRV.C R42.2
N$38
  Top 0.406: U1.6 93.98,60.55 93.98,59.3 C10.2
N$101  (via drill 2.54)
  other vias: 97.16,14.61
N$102  (via drill 2.54)
  other vias: 85.16,14.61
PWM0  (via drill 0.38)
  Top 0.203: IC4.19 20.06,64.99 21.72,66.65 21.72,68.2 20.38,69.53 v20.32,69.53 | R17.2 16.56,79.37 16.9,79.48 18.49,77.89 v18.92,77.89
  Bottom 0.203: v20.32,69.53 20.32,76.75 19.18,77.89 v18.92,77.89
PWM1
  Top 0.203: IC4.46 18.06,75.11 17.26,75.91 R18.2
PWM_EXTRA
  Top 0.203: IC4.32 24.36,69.5 25.82,69.5 26.81,70.48 AUX.TP
PWM_OUT
  Top 0.508: MUSIC_OUT.1 6.18,75.78 10.21,79.81 12.83,79.81 | 12.83,79.81 13.84,79.81 15.3,81.27 R17.1 | R18.1 14.82,77.81 12.83,79.81
SAFETY  (via drill 0.38)
  Top 0.203: IC4.41 20.56,74.43 21.99,75.86 29.29,75.86 44.45,91.01 65.96,91.01 67.44,89.53 v68.33,89.53
  Top 0.508: IC6.1 79.88,93.73 79.88,96.52 76.96,99.44 IC5.7 76.96,102.74 79.5,105.28 IC5.1 79.5,108.33 82.49,108.33 R2.1
  Bottom 0.254: 76.96,89.53 v68.33,89.53
  Bottom 0.508: IC6.7 76.96,89.53 76.96,89.92 79.5,92.46 IC6.1
SNS1
  Top 0.762: TRIM-.1 32.89,102.49 R20.1 29.85,101.16 R43.2
SNS2
  Top 0.762: R44.1 27.56,106.36 | 27.56,106.36 31.3,106.36 TRIM+.1 | R21.1 27.43,106.23 27.56,106.36
SNS_OUT
  Top 0.508: IC1.5 15.37,107.19 16.38,108.2 AMP.1
  Top 0.762: IC1.1 20.83,98.17 19.18,99.82 19.18,104.01 17.4,105.79 IC1.5
SNS_THR
  Top 0.203: THR.2 11.54,104.52 14.48,107.46 TP10.TP
  Top 0.762: THR.2 13.34,104.52 14.61,103.25 IC1.6
SWDCLK  (via drill 0.38)
  Top 0.203: IC4.37 22.71,73.21 v23.11,73.61 | v23.14,77.99 19.9,77.99 17.78,80.11 17.78,82.02 17.45,82.35 11.01,82.35 8.89,84.47 8.89,85.55 JTAG.3
  Bottom 0.203: v23.11,73.61 23.11,77.85 23.14,77.88 v23.14,77.99
SWDIO  (via drill 0.38)
  Top 0.203: v24.11,73.66 25.27,73.66 25.8,73.13 25.8,70.89 25.37,70.46 IC4.34 | v24.13,77.99 24.13,78.28 23.52,78.89 20.04,78.89 18.36,80.57 18.36,82.33 17.64,83.06 13.08,83.06 12.8,83.06 12.45,83.06 11.68,83.82 11.68,85.8 JTAG.2
  Bottom 0.203: v24.11,73.66 24.11,77.96 v24.13,77.99
UART_RX_STROBE  (via drill 0.38)
  Top 0.203: v21.97,62.48 21.97,62.93 21.56,63.34 IC4.22
  Bottom 0.203: v21.97,62.48 21.97,62.97 21.58,63.36 20.62,63.36 20.4,63.14 13.69,63.14 UART.3
UART_TX  (via drill 0.38)
  Top 0.203: v20.93,62.61 21.06,62.75 IC4.21
  Bottom 0.203: UART.2 13.95,61.09 15.47,62.61 v20.93,62.61
VBIAS
  Top 0.203: C38.1 25.77,95 | C38.1 26.11,94.8 | C38.1 26.3,95 | R47.2 26.11,96.13
  Top 0.508: R1.1 24.57,95 25.77,95 | 26.3,95 27.62,95 R45.2 R46.2 | 26.11,96.13 26.11,94.8
VDET  (via drill 0.38)
  Top 0.254: R1.2 22.13,95.22 19.18,98.17 v18.42,98.17
  Top 0.508: 23.24,109.97 C31.1 23.37,110.44 23.37,109.97 | C48.1 22.23,110.09 22.35,109.97
  Top 0.762: R21.2 27.57,109.97 | R20.2 29.7,109.97 27.57,109.97 | 27.57,109.97 C32.1 23.37,109.97 23.24,109.97 22.35,109.97 17.91,109.97 17.89,109.98 9.91,109.98 8.62,108.7 8.62,102.23 | IC3.2 15.24,92.46 | 15.24,92.46 IC3.4 | 15.24,92.46 15.24,98.04 IC1.8 14.49,99.05 C36.1 | 7.38,99.01 C37.1 | 8.62,102.23 8.62,99.01 C37.1 | THR.1 8.62,102.23 | C37.1 11.9,99.01
  Top 1.016: R19.2 7.38,99.01 | 11.9,99.01 C36.1
  Bottom 0.254: v18.42,98.17 IC1.8
VDET_PWR
  Top 0.508: DET_PWR.A
  Top 0.762: DET_PWR.A 42.42,112.14 | 9.21,90.06 C35.1 | C40.1 4.99,90.06 C34.1
  Top 1.016: SW_DET.2 86.49,90.68 86.49,110.24 84.58,112.14 42.42,112.14 5.33,112.14 2.92,109.73 2.92,91.19 4.05,90.06 C34.1 9.21,90.06 | C35.1 11.61,90.06 IC3.3
VDRV
  Top 0.508: 52.52,110.11 R13.1 | 56.45,110.23 R14.1 | R15.1 62.92,77.79 D5.C | 67.7,83.12 C22.1 | C19.1 82.55,76.58
  Top 0.762: 52.32,110.3 52.52,110.11 | 56.39,110.3 56.45,110.23 | R4.1 65.59,83.06 R5.1 67.7,83.12 67.7,84.23 C41.1 | DRV.A 82.58,97.41 84.45,97.41 | C12.1 68.56,110.3 68.33,110.3 | C42.1 54.56,110.3 R13.1 | C43.1 47.42,110.3 R7.1 | C44.1 61.42,110.3 R12.1 | C13.1 65.86,110.3 63.88,110.3
  Top 1.016: R8.1 R7.1 52.32,110.3 | R13.1 56.39,110.3 | R14.1 R12.1 R11.1 63.88,110.3 68.33,110.3 83.69,110.3 84.45,109.53 84.45,97.41 84.45,76.72 D3.C | C18.1 79.63,76.96 80.01,76.58 | D7.C 65.53,78.11 | 65.53,78.11 D5.C | R4.1 65.53,81.47 65.53,78.11
  Top 1.27: IC2.8 80.01,76.58 82.55,76.58 84.58,76.58 D3.C D1.C 93.97,76.59 SW_DRV.2
  Bottom 1.016: D5.C 69.6,78.11 70.36,78.87 77.47,78.87 79.25,77.09 IC2.8
VLOGIC_PWR
  Top 0.508: C11.1 97.28,64.69 | U1.2 96.9,61.72 97.28,62.1 97.28,62.61 97.22,62.67 U1.3 | LOGIC.A 93.75,74.52 94.74,73.53 94.74,72.01 95.76,70.99 100.33,70.99
  Top 1.016: 97.28,64.69 97.28,62.61 97.28,55.99 C5.1 97.16,56.12 IC9.1
  Top 1.27: SW_DRV.3 100.33,77.98 | 100.33,77.98 100.33,70.99 100.33,67.74 C11.1 | SW_LOGIC.2 100.33,84.96 100.33,77.98
  Bottom 1.016: 97.16,54.76 IC9.1
VPWR_IN
  Top 0.203: D10.C C45.1
  Top 0.508: PWR.A 88.77,106.53 88.77,108.46 VIN.2
  Top 1.27: J1.1 96.52,98.68 | 96.52,98.68 96.52,96.9 97.28,96.14 | C29.1 96.52,98.68 | C21.1 96.52,98.68
  Top 1.524: SW_DET.3 SW_LOGIC.3 97.28,96.14 D10.C | J1.1 96.52,103 90.55,108.97 VIN.2

## Text on the board
Bottom: STM-BMC v1.0 / github.com/evilwombat
tNames: - | + | 12V | MBM1 :) | STM-BMC v1.0 (c) evilwombat | CONTRAST